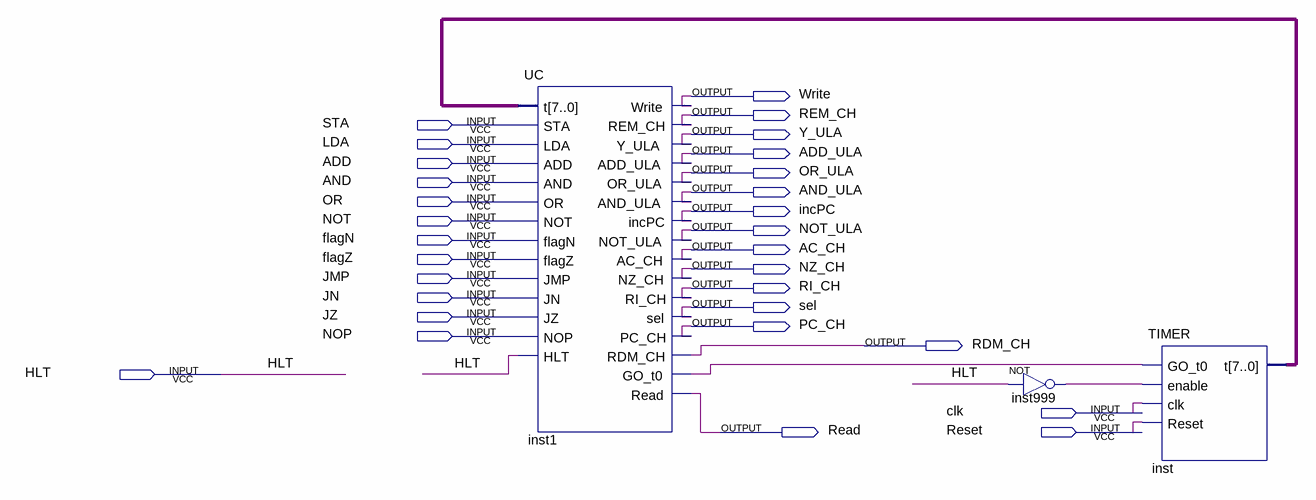
[diagram p0: schematic sheet]
// Quartus schematic UC_PLUS_TIMER.bdf as structural Verilog: 3 symbols, 30 pins
module UC_PLUS_TIMER (
  input  STA,
  input  LDA,
  input  ADD,
  input  AND,
  input  OR,
  input  NOT,
  input  flagN,
  input  flagZ,
  input  JMP,
  input  JN,
  input  JZ,
  input  NOP,
  input  HLT,
  input  clk,
  input  Reset,
  output Write,
  output REM_CH,
  output Y_ULA,
  output ADD_ULA,
  output OR_ULA,
  output AND_ULA,
  output incPC,
  output NOT_ULA,
  output AC_CH,
  output NZ_CH,
  output RI_CH,
  output sel,
  output PC_CH,
  output RDM_CH,
  output Read
);

  wire inst1_go_t0, inst999_out;
  wire [7:0] inst_t;

  UC inst1 (
    .t(inst_t), .STA(STA), .LDA(LDA), .ADD(ADD), .AND(AND), .OR(OR), .NOT(NOT), .flagN(flagN), .flagZ(flagZ),
    .JMP(JMP), .JN(JN), .JZ(JZ), .NOP(NOP), .HLT(HLT), .Write(Write), .REM_CH(REM_CH), .Y_ULA(Y_ULA),
    .ADD_ULA(ADD_ULA), .OR_ULA(OR_ULA), .AND_ULA(AND_ULA), .incPC(incPC), .NOT_ULA(NOT_ULA), .AC_CH(AC_CH),
    .NZ_CH(NZ_CH), .RI_CH(RI_CH), .sel(sel), .PC_CH(PC_CH), .RDM_CH(RDM_CH), .GO_t0(inst1_go_t0), .Read(Read));
  not inst999 (inst999_out, HLT);
  TIMER inst (.GO_t0(inst1_go_t0), .enable(inst999_out), .clk(clk), .Reset(Reset), .t(inst_t));
endmodule
